# EAGLE design LPC1115_4TE_TOP V1.0 (EAGLE 7.6.0)
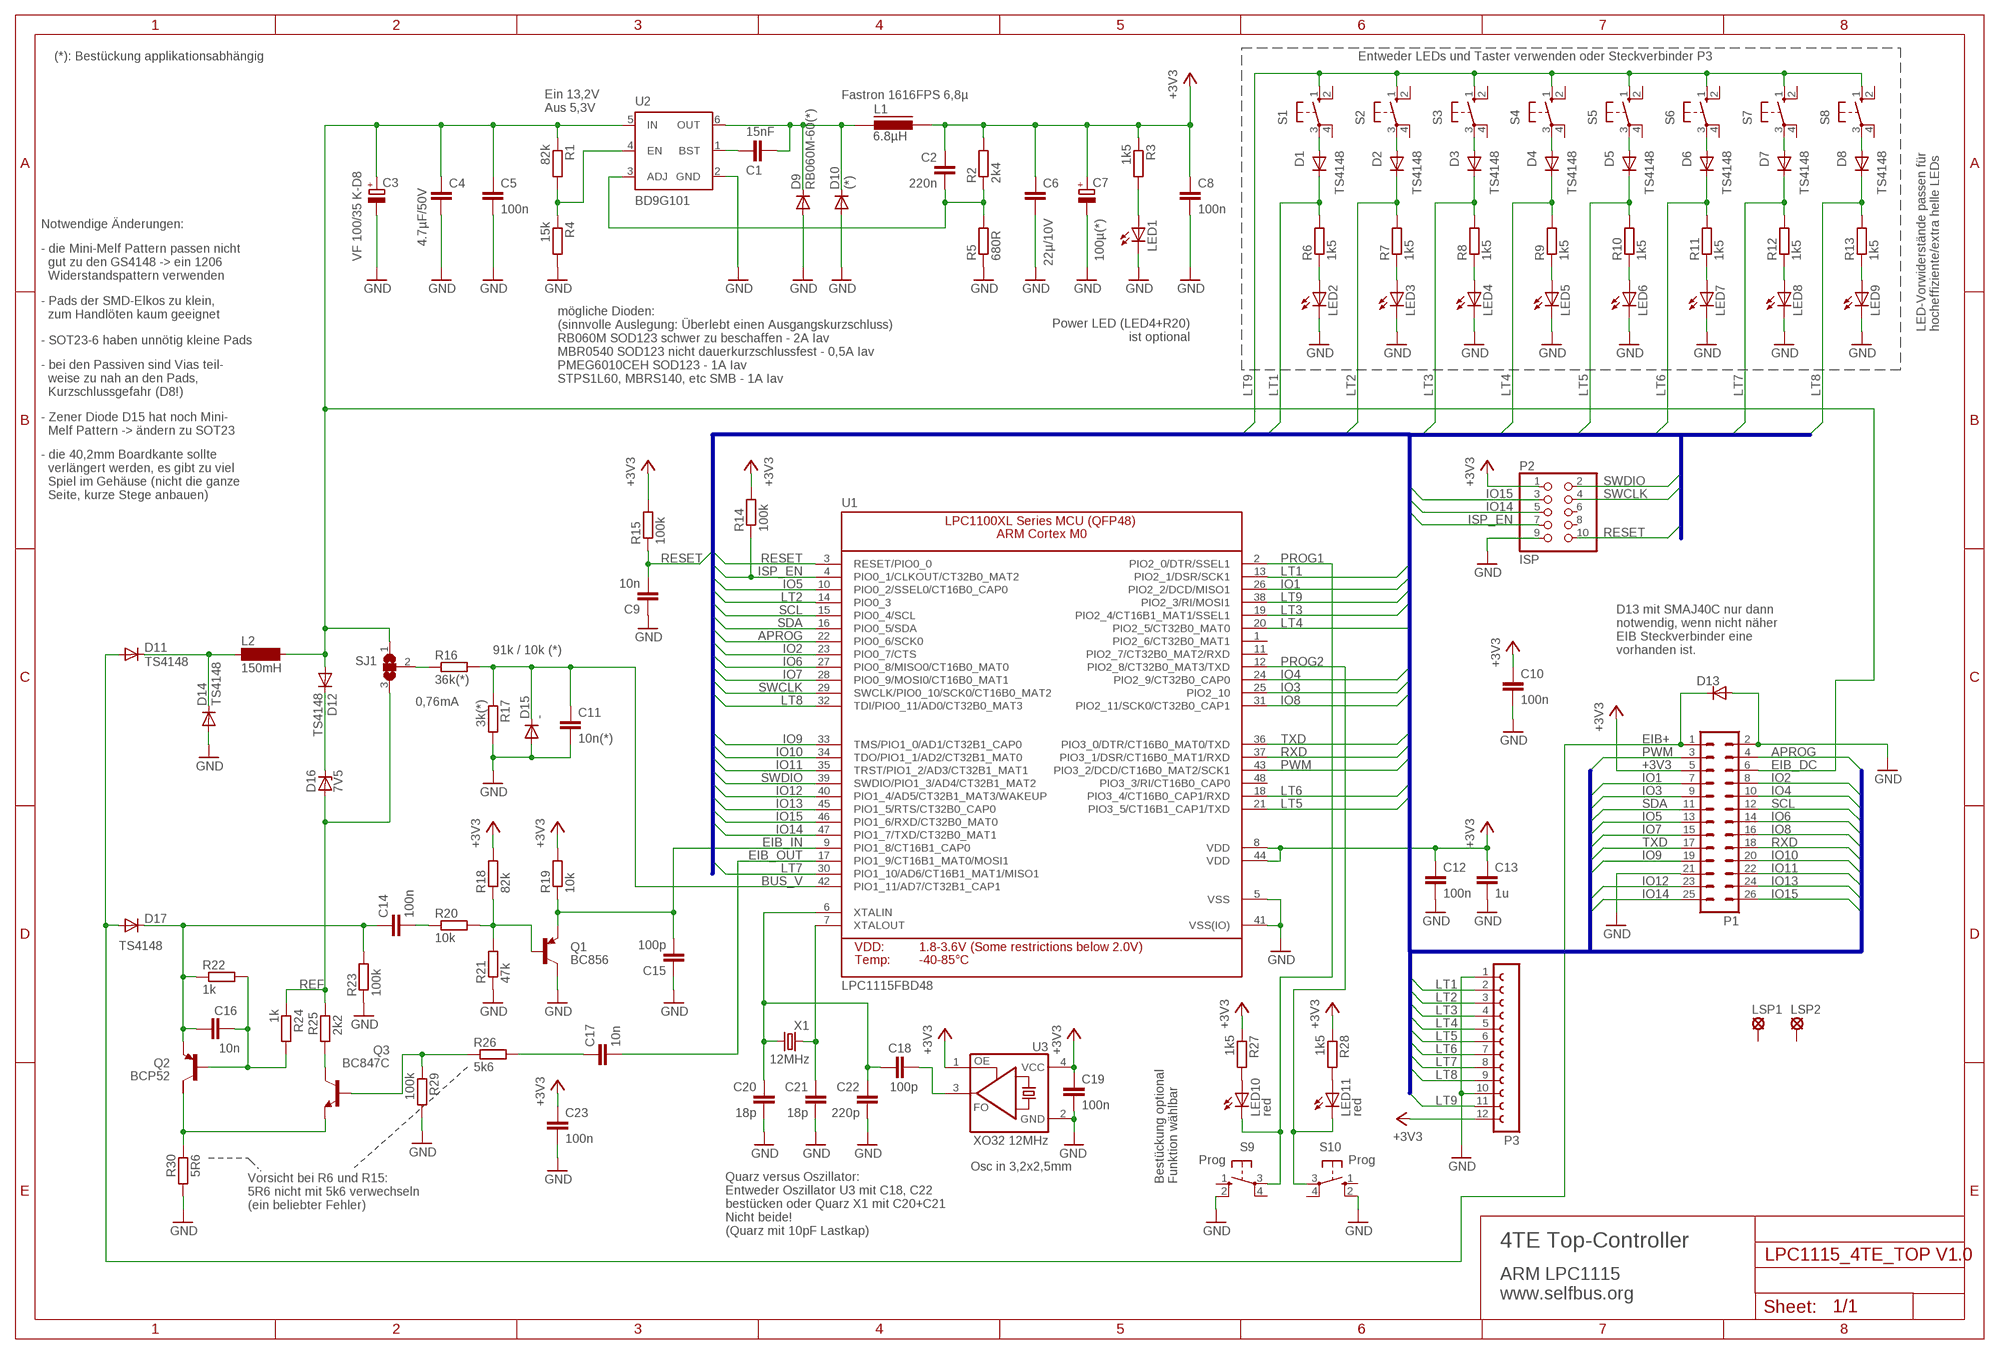
[diagram p0: schematic, sheet 1]

## Parts
C1  15nF  C-EUC0805M  [R0805M]
C2  220n  C-EUC0805M  [R0805M]
C3  VF 100/35 K-D8  CPOL-EUUD-6,3X7,7  [UD-6,3X7,7_NICHICON]
C4  4.7µF/50V  C-EUC1206M  [R1206M]
C5  100n  C-EUC0805M  [R0805M]
C6  22µ/10V  C-EUC1210K  [C1210K]
C7  100µ(*)  CPOL-EUUD-6,3X7,7  [UD-6,3X7,7_NICHICON]
C8  100n  C-EUC0805M  [R0805M]
C9  10n  C-EUC0805M  [R0805M]
C10  100n  C-EUC0805M  [R0805M]
C11  10n(*)  C-EUC0805M  [R0805M]
C12  100n  C-EUC0805M  [R0805M]
C13  1u  C-EUC0805M  [R0805M]
C14  100n  C-EUC0805M  [R0805M]
C15  100p  C-EUC0805M  [R0805M]
C16  10n  C-EUC0805M  [R0805M]
C17  10n  C-EUC0805M  [R0805M]
C18  100p  C-EUC0805M  [R0805M]
C19  100n  C-EUC0805M  [R0805M]
C20  18p  C-EUC0805M  [R0805M]
C21  18p  C-EUC0805M  [R0805M]
C22  220p  C-EUC0805M  [R0805M]
C23  100n  C-EUC0805M  [R0805M]
D1  TS4148  DIODE-MINIMELF  [MINIMELF]
D2  TS4148  DIODE-MINIMELF  [MINIMELF]
D3  TS4148  DIODE-MINIMELF  [MINIMELF]
D4  TS4148  DIODE-MINIMELF  [MINIMELF]
D5  TS4148  DIODE-MINIMELF  [MINIMELF]
D6  TS4148  DIODE-MINIMELF  [MINIMELF]
D7  TS4148  DIODE-MINIMELF  [MINIMELF]
D8  TS4148  DIODE-MINIMELF  [MINIMELF]
D9  RB060M-60(*)  DIODE-SOD123  [SOD123]
D10  (*)  DIODE-SMB  [SMB]
D11  TS4148  DIODE-MINIMELF  [MINIMELF]
D12  TS4148  DIODE-MINIMELF  [MINIMELF]
D13  D-SMB  [SMB]
D14  TS4148  DIODE-MINIMELF  [MINIMELF]
D15  -  DIODE-MINIMELF  [MINIMELF]
D16  7V5  ZENER-DIODESOT23  [SOT23]
D17  TS4148  DIODE-MINIMELF  [MINIMELF]
L1  6.8µH  IND_FASTRON_1616FPSB  [1616FPS]
L2  150mH  SD12BS11_LIEGEND  [BS11_LIEGEND]
LED1  LEDSMT1206  [1206]
LED2  LEDSMT1206  [1206]
LED3  LEDSMT1206  [1206]
LED4  LEDSMT1206  [1206]
LED5  LEDSMT1206  [1206]
LED6  LEDSMT1206  [1206]
LED7  LEDSMT1206  [1206]
LED8  LEDSMT1206  [1206]
LED9  LEDSMT1206  [1206]
LED10  red  LEDSMT1206  [1206]
LED11  red  LEDSMT1206  [1206]
LSP1  SE13_SM  [SE13_SM]
LSP2  SE13_SM  [SE13_SM]
P1  ML26  [ML26]
P2  ISP  PINHD-2X05_2.00  [2X05M]
P3  FE12-1  [FE12]
Q1  BC856  BC856BSMD  [SOT23-BEC]
Q2  BCP52  FZT753SMD  [SOT223]
Q3  BC847C  BC847  [SOT23]
R1  82k  R-EU_R0805M  [R0805M]
R2  2k4  R-EU_R0805M  [R0805M]
R3  1k5  R-EU_R0805M  [R0805M]
R4  15k  R-EU_R0805M  [R0805M]
R5  680R  R-EU_R0805M  [R0805M]
R6  1k5  R-EU_R0805M  [R0805M]
R7  1k5  R-EU_R0805M  [R0805M]
R8  1k5  R-EU_R0805M  [R0805M]
R9  1k5  R-EU_R0805M  [R0805M]
R10  1k5  R-EU_R0805M  [R0805M]
R11  1k5  R-EU_R0805M  [R0805M]
R12  1k5  R-EU_R0805M  [R0805M]
R13  1k5  R-EU_R0805M  [R0805M]
R14  100k  R-EU_R0805M  [R0805M]
R15  100k  R-EU_R0805M  [R0805M]
R16  36k(*)  R-EU_R0805M  [R0805M]
R17  3k(*)  R-EU_R0805M  [R0805M]
R18  82k  R-EU_R0805M  [R0805M]
R19  10k  R-EU_R0805M  [R0805M]
R20  10k  R-EU_R0805M  [R0805M]
R21  47k  R-EU_R0805M  [R0805M]
R22  1k  R-EU_R0805M  [R0805M]
R23  100k  R-EU_R0805M  [R0805M]
R24  1k  R-EU_R0805M  [R0805M]
R25  2k2  R-EU_R0805M  [R0805M]
R26  5k6  R-EU_R0805M  [R0805M]
R27  1k5  R-EU_R0805M  [R0805M]
R28  1k5  R-EU_R0805M  [R0805M]
R29  100k  R-EU_R0805M  [R0805M]
R30  5R6  R-EU_R1206M  [R1206M]
S1  10-XXSMD  [B3F-10XX_SMD]
S2  10-XXSMD  [B3F-10XX_SMD]
S3  10-XXSMD  [B3F-10XX_SMD]
S4  10-XXSMD  [B3F-10XX_SMD]
S5  10-XXSMD  [B3F-10XX_SMD]
S6  10-XXSMD  [B3F-10XX_SMD]
S7  10-XXSMD  [B3F-10XX_SMD]
S8  10-XXSMD  [B3F-10XX_SMD]
S9  Prog  10-XXSMD  [B3F-10XX_SMD]
S10  Prog  10-XXSMD  [B3F-10XX_SMD]
SJ1  SJ2W  [SJ_2]
U1  LPC1115FBD48  LPC1113/4/5_QFP48_XLSERIES  [LQFP48]
U2  BD9G101  BD9G101GBD9G101G-SOT23-6  [SOT23-6]
U3  XO32 12MHz  ASFL  [ASF]
X1  12MHz  CRYSTALASF  [ASF]

## Nets
+3V3: C2.1 C6.1 C7.+ C8.1 C10.1 C12.1 C13.1 C19.1 C23.1 L1.P$2 P1.5 P2.1 P3.12 R2.2 R3.1 R14.2 R15.2 R18.2 R19.2 R27.1 R28.1 U1.8(VDD) U1.44(VDD) U3.1(OE) U3.4(VCC)
APROG: P1.4 U1.22(PIO0_6/SCK0)
BUS_V: C11.1 D15.C R16.2 R17.1 U1.42(PIO1_11/AD7/CT32B1_CAP1)
DRAIN: C14.1 C16.1 D17.C Q2.3(E) R22.1 R23.2
EIB+: D11.A D13.1(C) D17.A P1.1
EIB_DC: C3.+ C4.1 C5.1 D12.A L2.2 P1.6 R1.1 SJ1.1 U2.5(IN)
EIB_IN: C15.2 Q1.E R19.1 U1.9(PIO1_8/CT16B1_CAP0)
EIB_OUT: C17.2 U1.17(PIO1_9/CT16B1_MAT0/MOSI1)
GND: C3.- C4.2 C5.2 C6.2 C7.- C8.2 C9.1 C10.2 C11.2 C12.2 C13.2 C15.1 C19.2 C20.2 C21.2 C22.2 C23.2 D9.A D10.A D13.2(A) D14.A D15.A LED1.C LED2.C LED3.C LED4.C LED5.C LED6.C LED7.C LED8.C LED9.C P1.2 P1.21 P2.9 P3.1 P3.10 Q1.C R4.2 R5.1 R17.2 R21.1 R23.1 R29.2 R30.1 S9.2(S1) S10.2(S1) U1.5(VSS) U1.41(VSS(IO)) U2.2(GND) U3.2(GND)
IO1: P1.7 U1.26(PIO2_2/DCD/MISO1)
IO2: P1.8 U1.23(PIO0_7/CTS)
IO3: P1.9 U1.25(PIO2_10)
IO4: P1.10 U1.24(PIO2_9/CT32B0_CAP0)
IO5: P1.13 U1.10(PIO0_2/SSEL0/CT16B0_CAP0)
IO6: P1.14 U1.27(PIO0_8/MISO0/CT16B0_MAT0)
IO7: P1.15 U1.28(PIO0_9/MOSI0/CT16B0_MAT1)
IO8: P1.16 U1.31(PIO2_11/SCK0/CT32B0_CAP1)
IO9: P1.19 U1.33(TMS/PIO1_0/AD1/CT32B1_CAP0)
IO10: P1.20 U1.34(TDO/PIO1_1/AD2/CT32B1_MAT0)
IO11: P1.22 U1.35(TRST/PIO1_2/AD3/CT32B1_MAT1)
IO12: P1.23 U1.40(PIO1_4/AD5/CT32B1_MAT3/WAKEUP)
IO13: P1.24 U1.45(PIO1_5/RTS/CT32B0_CAP0)
IO14: P1.25 P2.5 U1.47(PIO1_7/TXD/CT32B0_MAT1)
IO15: P1.26 P2.3 U1.46(PIO1_6/RXD/CT32B0_MAT0)
ISP_EN: P2.7 R14.1 U1.4(PIO0_1/CLKOUT/CT32B0_MAT2)
LT1: D1.C P3.2 R6.2 U1.13(PIO2_1/DSR/SCK1)
LT2: D2.C P3.3 R7.2 U1.14(PIO0_3)
LT3: D3.C P3.4 R8.2 U1.19(PIO2_4/CT16B1_MAT1/SSEL1)
LT4: D4.C P3.5 R9.2 U1.20(PIO2_5/CT32B0_MAT0)
LT5: D5.C P3.6 R10.2 U1.21(PIO3_5/CT16B1_CAP1/TXD)
LT6: D6.C P3.7 R11.2 U1.18(PIO3_4/CT16B0_CAP1/RXD)
LT7: D7.C P3.8 R12.2 U1.30(PIO1_10/AD6/CT16B1_MAT1/MISO1)
LT8: D8.C P3.9 R13.2 U1.32(TDI/PIO0_11/AD0/CT32B0_MAT3)
LT9: P3.11 S1.1(S) S2.1(S) S3.1(S) S4.1(S) S5.1(S) S6.1(S) S7.1(S) S8.1(S) U1.38(PIO2_3/RI/MOSI1)
LX: C1.1 D9.C D10.C L1.P$1 U2.6(OUT)
N$1: C17.1 R26.2
N$2: C14.2 R20.1
N$3: C21.1 U1.7(XTALOUT) X1.1
N$4: LED11.A R28.2
N$5: R16.1 SJ1.2
N$6: Q3.3(C) R25.1
N$7: Q2.2(C) Q3.2(E) R30.2
N$8: D11.C D14.C L2.1
N$9: D12.C D16.3(C)
N$12: Q3.1(B) R26.1 R29.1
N$13: LED1.A R3.2
N$14: Q1.B R18.1 R20.2 R21.2
N$15: C16.2 Q2.1(B) R22.2 R24.2
N$16: C18.1 U3.3(FO)
N$17: D8.A S8.3(P)
N$19: C1.2 U2.1(BST)
N$20: R1.2 R4.1 U2.4(EN)
N$22: C18.2 C20.1 C22.1 U1.6(XTALIN) X1.3
N$23: D7.A S7.3(P)
N$24: C2.2 R2.1 R5.2 U2.3(ADJ)
N$25: LED2.A R6.1
N$28: D6.A S6.3(P)
N$29: D5.A S5.3(P)
N$30: D4.A S4.3(P)
N$31: D3.A S3.3(P)
N$32: D2.A S2.3(P)
N$33: LED3.A R7.1
N$34: D1.A S1.3(P)
N$35: LED10.A R27.2
N$48: LED4.A R8.1
N$50: LED5.A R9.1
N$51: LED6.A R10.1
N$53: LED7.A R11.1
N$55: LED8.A R12.1
N$57: LED9.A R13.1
PROG1: LED10.C S9.3(P) U1.2(PIO2_0/DTR/SSEL1)
PROG2: LED11.C S10.3(P) U1.12(PIO2_8/CT32B0_MAT3/TXD)
PWM: P1.3 U1.43(PIO3_2/DCD/CT16B0_MAT2/SCK1)
REF: D16.1(A) R24.1 R25.2 SJ1.3
RESET: C9.2 P2.10 R15.1 U1.3(RESET/PIO0_0)
RXD: P1.18 U1.37(PIO3_1/DSR/CT16B0_MAT1/RXD)
SCL: P1.12 U1.15(PIO0_4/SCL)
SDA: P1.11 U1.16(PIO0_5/SDA)
SWCLK: P2.4 U1.29(SWCLK/PIO0_10/SCK0/CT16B0_MAT2)
SWDIO: P2.2 U1.39(SWDIO/PIO1_3/AD4/CT32B1_MAT2)
TXD: P1.17 U1.36(PIO3_0/DTR/CT16B0_MAT0/TXD)
Unconnected: LSP1.MP LSP2.MP P2.6 P2.8 Q2.4(C/) S1.2(S1) S1.4(P1) S2.2(S1) S2.4(P1) S3.2(S1) S3.4(P1) S4.2(S1) S4.4(P1) S5.2(S1) S5.4(P1) S6.2(S1) S6.4(P1) S7.2(S1) S7.4(P1) S8.2(S1) S8.4(P1) S9.1(S) S9.4(P1) S10.1(S) S10.4(P1) U1.1(PIO2_6/CT32B0_MAT1) U1.11(PIO2_7/CT32B0_MAT2/RXD) U1.48(PIO3_3/RI/CT16B0_CAP0)

## Buses
IO[1..15],LT[1..9],SCL,SDA,PWM,APROG,RXD,TXD,RESET,SWCLK,SWDIO,ISP_EN

## Notes on the sheet
- (*): Bestückung applikationsabhängig | Entweder LEDs und Taster verwenden oder Steckverbinder P3
- Fastron 1616FPS 6,8µ
- Ein 13,2V
  Aus 5,3V
- Notwendige Änderungen:
- - die Mini-Melf Pattern passen nicht
    gut zu den GS4148 -> ein 1206
    Widerstandspattern verwenden
- - Pads der SMD-Elkos zu klein,
    zum Handlöten kaum geeignet
- Power LED (LED4+R20)
  ist optional
- LED-Vorwiderstände passen für 
  hocheffiziente/extra helle LEDs
- - SOT23-6 haben unnötig kleine Pads
- mögliche Dioden:
  (sinnvolle Auslegung: Überlebt einen Ausgangskurzschluss)
  RB060M SOD123 schwer zu beschaffen - 2A Iav
  MBR0540 SOD123 nicht dauerkurzschlussfest - 0,5A Iav
  PMEG6010CEH SOD123 - 1A Iav
  STPS1L60, MBRS140, etc SMB - 1A Iav
- - bei den Passiven sind Vias teil-
    weise zu nah an den Pads,
    Kurzschlussgefahr (D8!)
- - Zener Diode D15 hat noch Mini-
    Melf Pattern -> ändern zu SOT23
- - die 40,2mm Boardkante sollte
    verlängert werden, es gibt zu viel
    Spiel im Gehäuse (nicht die ganze
    Seite, kurze Stege anbauen)
- 91k / 10k (*)
- D13 mit SMAJ40C nur dann
  notwendig, wenn nicht näher
  EIB Steckverbinder eine
  vorhanden ist.
- 0,76mA
- Osc in 3,2x2,5mm
- Bestückung optional
  Funktion wählbar
- Vorsicht bei R6 und R15:
  5R6 nicht mit 5k6 verwechseln
  (ein beliebter Fehler)
- Quarz versus Oszillator:
  Entweder Oszillator U3 mit C18, C22
  bestücken oder Quarz X1 mit C20+C21
  Nicht beide!
  (Quarz mit 10pF Lastkap)
- 4TE Top-Controller
- ARM LPC1115
  www.selfbus.org

## Library data of the parts
C1 C2 C4-C6 C8-C23 = rcl:C-EU: CAPACITOR, European symbol
C3 C7 = rcl:CPOL-EU: POLARIZED CAPACITOR, European symbol
D1-D12 D14 D15 D17 = diode:DIODE-: DIODE
D13 = semicon-smd-ipc:D-: DIODE unfilled
D16 = diode:ZENER-DIODE: Z-Diode
L1 = Stefan_selfbus:IND_FASTRON_1616FPS
L2 = inductor-neosid:SD12: INDUCTOR nominal inductance
LED1-LED11 = led:LED: LED OSRAM: - CHIPLED LG R971, LG N971, LY N971, LG Q971, LY Q971, LO R971, LY R971 LH N974, LH R974 LS Q976, LO Q976, LY Q976 LO Q996 - Hyper CHIPLED LW Q18S LB Q993, LB Q99A, LB R99A - SideLED LS A670, LO A670, LY A670, LG A670, LP A670 LB A673, LV A673, LT A673, LW A673 LH A674 LY A675 LS A676, LA A676, LO A676, LY A676, LW A676 LS A679, LY A679, LG A679 - Hyper Micro SIDELED® LS Y876, LA Y876, LO Y876, LY Y876 LT Y87S - SmartLED LW L88C, LW L88S LB L89C, LB L89S, LG L890 LS L89K, LO L89K, LY L89K LS L896, LA L896, LO L896, LY L896 - TOPLED LS T670, LO T670, LY T670, LG T670, LP T670 LSG T670, LSP T670, LSY T670, LOP T670, LYG T670 LG T671, LOG T671, LSG T671 LB T673, LV T673, LT T673, LW T673 LH T674 LS T676, LA T676, LO T676, LY T676, LB T676, LH T676, LSB T676, LW T676 LB T67C, LV T67C, LT T67C, LS T67K, LO T67K, LY T67K, LW E67C LS E67B, LA E67B, LO E67B, LY E67B, LB E67C, LV E67C, LT E67C LW T67C LS T679, LY T679, LG T679 LS T770, LO T770, LY T770, LG T770, LP T770 LB T773, LV T773, LT T773, LW T773 LH T774 LS E675, LA E675, LY E675, LS T675 LS T776, LA T776, LO T776, LY T776, LB T776 LHGB T686 LT T68C, LB T68C - Hyper Mini TOPLED® LB M676 - Mini TOPLED Santana® LG M470 LS M47K, LO M47K, LY M47K Source: http://www.osram.convergy.de - LUMILED® LXK2-PW12-R00, LXK2-PW12-S00, LXK2-PW14-U00, LXK2-PW14-V00 LXK2-PM12-R00, LXK2-PM12-S00, LXK2-PM14-U00 LXK2-PE12-Q00, LXK2-PE12-R00, LXK2-PE12-S00, LXK2-PE14-T00, LXK2-PE14-U00 LXK2-PB12-K00, LXK2-PB12-L00, LXK2-PB12-M00, LXK2-PB14-N00, LXK2-PB14-P00, LXK2-PB14-Q00 LXK2-PR12-L00, LXK2-PR12-M00, LXK2-PR14-Q00, LXK2-PR14-R00 LXK2-PD12-Q00, LXK2-PD12-R00, LXK2-PD12-S00 LXK2-PH12-R00, LXK2-PH12-S00 LXK2-PL12-P00, LXK2-PL12-Q00, LXK2-PL12-R00 Source: www.luxeon.com
LSP1 LSP2 = solpad:SE13: SOLDER PAD E1542, drill 1,3mm, distributor Buerklin, 07F815
P1 = con-harting-ml:ML26: HARTING; OC_FARNELL: unknown; OC_NEWARK: unknown
P2 = pinhead-2:PINHD-2X05: PIN HEADER
P3 = con-lsta:FE12-1: FEMALE HEADER; OC_FARNELL: unknown; OC_NEWARK: unknown
Q1 = transistor-pnp:BC856*: PNP Transistror
Q2 = transistor-pnp:FZT753SMD: PNP Transistor
Q3 = transistor:BC847: NPN TRANSISTOR
R1-R30 = rcl:R-EU_: RESISTOR, European symbol
S1-S10 = switch-omron:10-XX: OMRON SWITCH
SJ1 = jumper:SJ2W: SMD solder JUMPER
U1 = microbuilder:LPC1113/4/5_QFP48_XLSERIES: LPC1113/4/5 ARM Cortex M0 MCU (50MHz) - XL Series (FBD48/3x3) LPC1115FBD48/303: Max Frequency: 50MHz Flash: 64kB SRAM: 8kB ADC: 10-bit
U2 = Stefan_selfbus:BD9G101G
U3 = crystal:ASF*: CRYSTAL CLOCK OSCILLATORS 5.0 Vdc or 3.3 Vdc - LOW PROFILE ULTRA MINIATURE CERAMIC SURFACE MOUNT Source: http://www.abracon.com/Oscillators/asf1-L-L1.pdf
X1 = crystal:CRYSTAL: CRYSTAL

## Board
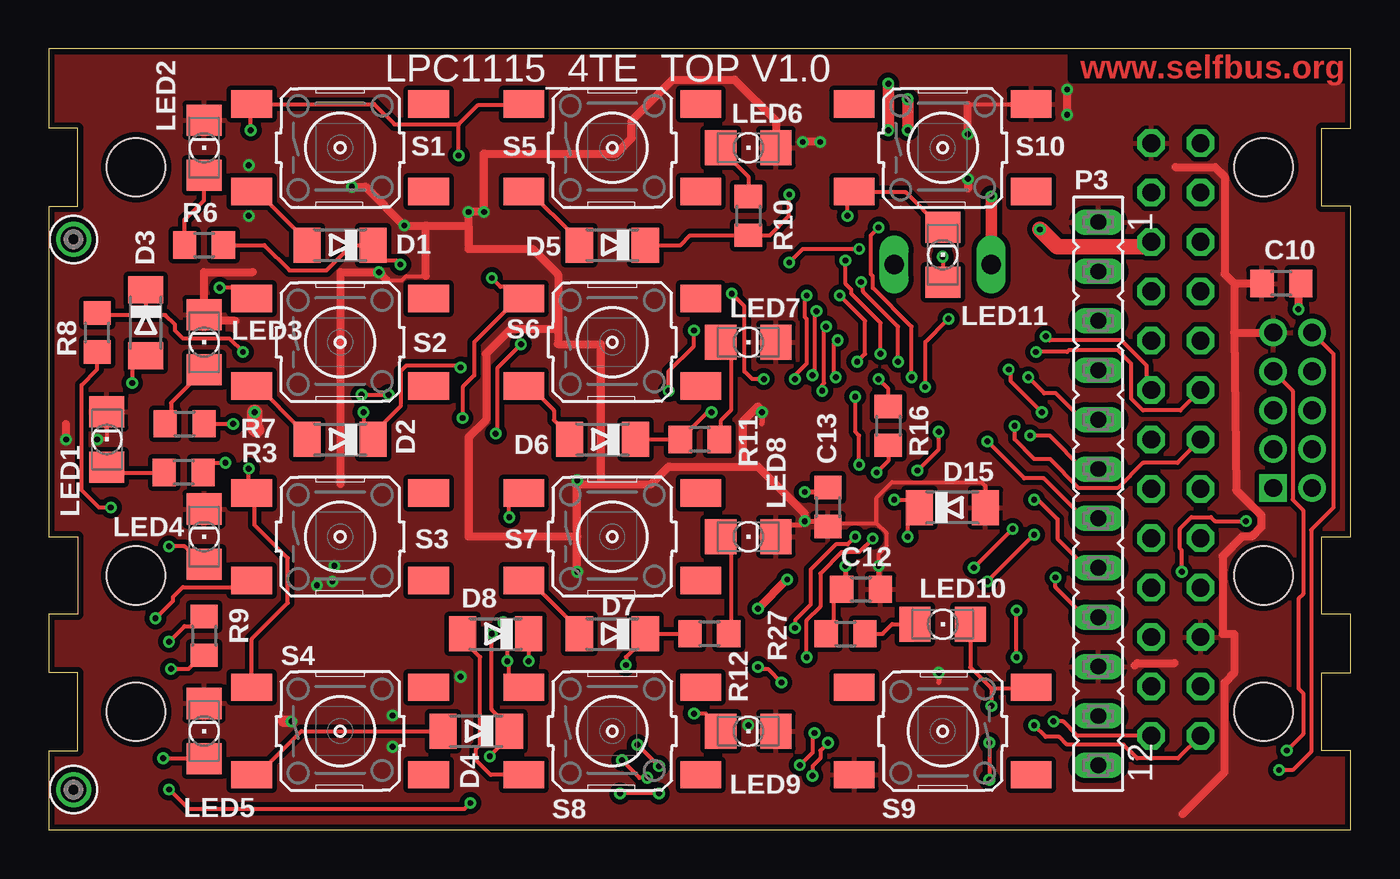
[diagram p1: board, top side]
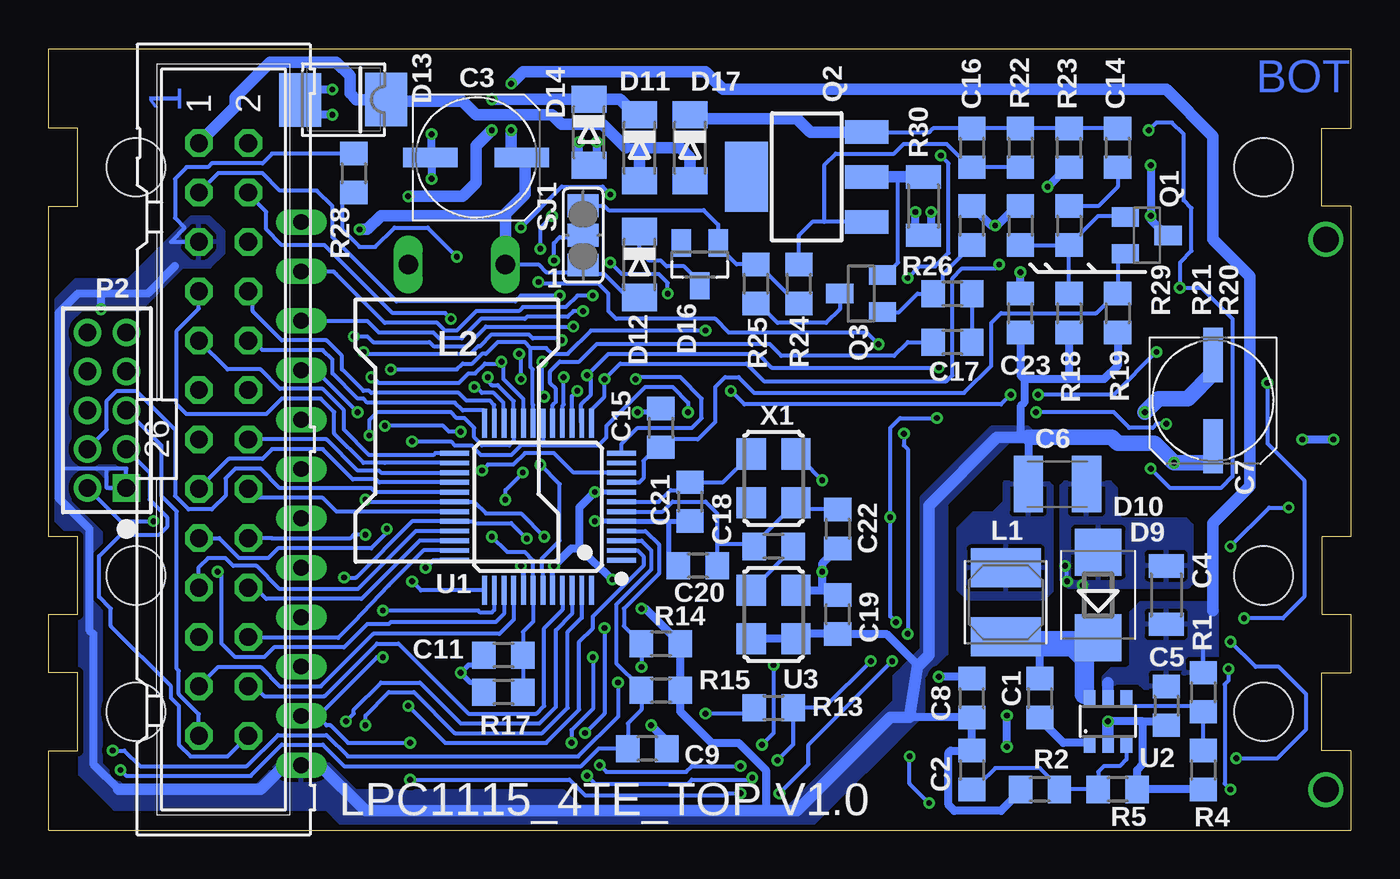
[diagram p2: board, bottom side, seen from below]

Size 67 x 40.2 mm. Coordinates in mm from the lower left corner, seen from the top.
Outline: 67,0 67,4.1 65.5,4.1 65.5,8.1 67,8.1 67,11.1 65.5,11.1 65.5,15.1 67,15.1 67,32.1 65.5,32.1 65.5,36.1 67,36.1 67,40.2 0,40.2 0,36.1 1.5,36.1 1.5,32.1 0,32.1 0,15.1 1.5,15.1 1.5,11.1 0,11.1 0,8.1 1.5,8.1 1.5,4.1 0,4.1 0,0 67,0
Copper layers (1*16): Top 0.035mm / dielectric 1.5mm / Bottom 0.035mm
Design rules "default *": minimum track width 0.18mm, minimum drill 0.3mm, track to track 0.18mm, track to pad 0.18mm, pad to pad 0.18mm, via to via 0.18mm, smd to smd 0.18mm, copper to edge 0.3mm, drill to drill 0.3mm, minimum pad ring 0.25mm, minimum via ring 0.15mm, stop-mask expansion 0.075mm, vias tented up to drill 12mil, thermal gap 0.2mm
Holes 3 mm at 62.5,6.1 4.5,6.1 4.5,34.1 62.5,34.1 4.5,13.1 62.5,13.1
bRestrict: area 23.6,16 to 24,16.2

### Footprints (pad centres in the part's own frame; a part is rotated, then mirrored left to right if it is on the bottom)
R0805M = smd 1.2 x 1.4: 1 -1,0; 2 1,0
UD-6,3X7,7_NICHICON = smd 2.8 x 1: + 2.35,0; - -2.35,0
R1206M = smd 1.2 x 1.8: 1 -1.5,0; 2 1.5,0
C1210K = smd 1.5 x 2.9: 1 -1.5,0; 2 1.5,0
MINIMELF = smd 1.4 x 1.8: A 1.7,0; C -1.7,0
SOD123 = smd 1.4 x 1.4: A 1.9,0; C -1.9,0
SMB = smd 2.4 x 2.4: A 2.2,0; C -2.2,0
SMB' = smd 2.159 x 2.743: 1 -2.311,-0.127; 2 2.108,-0.102
SOT23 = smd 1 x 1.4: 1 -0.95,-1.1; 2 0.95,-1.1; 3 0,1.1
1616FPS = smd 3.6 x 2: P$1 0,1.775; P$2 0,-1.775
BS11_LIEGEND = drill 1 long: 1 -2.5,0; 2 2.5,0
1206 = smd 1.6 x 1.803: A -1.422,0; C 1.422,0
SE13_SM = drill 1.3: MP 0,0
ML26 = drill 0.914 octagon: 1 -15.24,-1.27; 2 -15.24,1.27; 3 -12.7,-1.27; 4 -12.7,1.27; 5 -10.16,-1.27; 6 -10.16,1.27; 7 -7.62,-1.27; 8 -7.62,1.27; 9 -5.08,-1.27; 10 -5.08,1.27; 11 -2.54,-1.27; 12 -2.54,1.27; 13 0,-1.27; 14 0,1.27; 15 2.54,-1.27; 16 2.54,1.27; 17 5.08,-1.27; 18 5.08,1.27; 19 7.62,-1.27; 20 7.62,1.27; 21 10.16,-1.27; 22 10.16,1.27; 23 12.7,-1.27; 24 12.7,1.27; 25 15.24,-1.27; 26 15.24,1.27
2X05M = drill 0.914 square: 1 -4,-1 | drill 0.914: 2 -4,1; 3 -2,-1; 4 -2,1; 5 0,-1; 6 0,1; 7 2,-1; 8 2,1; 9 4,-1; 10 4,1
FE12 = drill 0.813 long: 1 -13.97,0; 2 -11.43,0; 3 -8.89,0; 4 -6.35,0; 5 -3.81,0; 6 -1.27,0; 7 1.27,0; 8 3.81,0; 9 6.35,0; 10 8.89,0; 11 11.43,0; 12 13.97,0
SOT23-BEC = smd 1 x 1.4: B -0.95,-1.1; C 0,1.1; E 0.95,-1.1
SOT223 = smd 1.219 x 2.235: 1 -2.311,-3.099; 2 0,-3.099; 3 2.311,-3.099 | smd 3.6 x 2.2: 4 0,3.099
B3F-10XX_SMD = smd 2.1 x 1.4: 1 -4.55,2.25; 2 4.55,2.25; 3 -4.55,-2.25; 4 4.55,-2.25
SJ_2 = smd 1.168 x 1.6: 1 -1.524,0; 2 0,0; 3 1.524,0
LQFP48 = smd 1.5 x 0.25: 1 -4.3,2.75; 2 -4.3,2.25; 3 -4.3,1.75; 4 -4.3,1.25; 5 -4.3,0.75; 6 -4.3,0.25; 7 -4.3,-0.25; 8 -4.3,-0.75; 9 -4.3,-1.25; 10 -4.3,-1.75; 11 -4.3,-2.25; 12 -4.3,-2.75; 25 4.3,-2.75; 26 4.3,-2.25; 27 4.3,-1.75; 28 4.3,-1.25; 29 4.3,-0.75; 30 4.3,-0.25; 31 4.3,0.25; 32 4.3,0.75; 33 4.3,1.25; 34 4.3,1.75; 35 4.3,2.25; 36 4.3,2.75 | smd 0.25 x 1.5: 13 -2.75,-4.3; 14 -2.25,-4.3; 15 -1.75,-4.3; 16 -1.25,-4.3; 17 -0.75,-4.3; 18 -0.25,-4.3; 19 0.25,-4.3; 20 0.75,-4.3; 21 1.25,-4.3; 22 1.75,-4.3; 23 2.25,-4.3; 24 2.75,-4.3; 37 2.75,4.3; 38 2.25,4.3; 39 1.75,4.3; 40 1.25,4.3; 41 0.75,4.3; 42 0.25,4.3; 43 -0.25,4.3; 44 -0.75,4.3; 45 -1.25,4.3; 46 -1.75,4.3; 47 -2.25,4.3; 48 -2.75,4.3
SOT23-6 = smd 0.6 x 0.9: 1 -0.95,-1.15; 2 0,-1.15; 3 0.95,-1.15; 4 0.95,1.15; 5 0,1.15; 6 -0.95,1.15
ASF = smd 1.6 x 1.5: 1 -1.25,-1.15; 2 1.25,-1.15; 3 1.25,1.15; 4 -1.25,1.15

### Placement (x,y rotation side)
C1  16,6.8 270 bottom
C2  19.5,3.1 270 bottom
C3  45,34.6 0 bottom
C4  9.5,12.1 90 bottom
C5  9.5,6.4 270 bottom
C6  15.1,17.8 0 bottom
C7  7.1,22.1 270 bottom
C8  19.5,6.8 90 bottom
C9  36.2,4.2 180 bottom
C10  63.42,28.12 180 top
C11  43.6,9 180 bottom
C12  41.8,12.4 0 top
C13  40.1,16.62 270 top
C14  12,35.1 270 bottom
C15  35.5,20.7 270 bottom
C16  19.5,35.1 270 bottom
C17  20.5,25.1 180 bottom
C18  29.7,14.6 180 bottom
C19  26.4,11.1 90 bottom
C20  33.6,13.6 180 bottom
C21  34,16.9 270 bottom
C22  26.4,15.5 270 bottom
C23  17,26.6 90 bottom
D1  15,30.1 180 top
D2  15,20.1 180 top
D3  5,26.1 270 top
D4  22,5.1 180 top
D5  29,30.1 180 top
D6  28.5,20.1 180 top
D7  29,10.1 180 top
D8  23,10.1 180 top
D9  13,12.1 90 bottom
D10  13,12.1 90 bottom
D11  36.6,35.1 270 bottom
D12  36.6,29.1 270 bottom
D13  [SMB']  51.95,37.45 180 bottom
D14  39.2,35.9 270 bottom
D15  46.5,16.6 0 top
D16  33.5,29.1 180 bottom
D17  34,35.1 270 bottom
L1  17.76,11.73 180 bottom
L2  46,29.1 0 bottom
LED1  3,20.1 90 top
LED2  8,35.1 90 top
LED3  8,25.1 90 top
LED4  8,15.1 90 top
LED5  8,5.1 90 top
LED6  36,35.1 0 top
LED7  36,25.1 0 top
LED8  36,15.1 0 top
LED9  36,5.1 0 top
LED10  46,10.6 0 top
LED11  46,29.6 90 top
LSP1  1.28,30.39 0 top
LSP2  1.28,2.09 0 top
P1  58,20.1 270 bottom
P2  64,21.6 90 bottom
P3  54,17.31 270 top
Q1  10.5,30.6 270 bottom
Q2  28,33.6 90 bottom
Q3  25.2,27.6 90 bottom
R1  7.6,7.1 270 bottom
R2  16,2.1 180 bottom
R3  6.95,18.4 180 top
R4  7.6,3.1 270 bottom
R5  12,2.1 180 bottom
R6  8,30.1 0 top
R7  7,20.9 0 top
R8  2.5,25.6 90 top
R9  8,10 270 top
R10  36,31.6 270 top
R11  33.5,20.1 180 top
R12  34,10.1 180 top
R13  29.7,6.3 0 bottom
R14  35.5,9.6 0 bottom
R15  35.5,7.2 0 bottom
R16  43.2,20.8 270 top
R17  43.6,7.1 180 bottom
R18  14.5,26.6 270 bottom
R19  12,26.6 270 bottom
R20  14.5,31.1 270 bottom
R21  17,31.1 270 bottom
R22  17,35.1 270 bottom
R23  14.5,35.1 90 bottom
R24  28.4,28.1 90 bottom
R25  30.6,28.1 90 bottom
R26  20.5,27.6 0 bottom
R27  41,10.1 0 top
R28  51.3,33.8 270 bottom
R29  19.5,31.1 90 bottom
R30  22,32.1 90 bottom
S1  15,35.1 0 top
S2  15,25.1 0 top
S3  15,15.1 0 top
S4  15,5.1 0 top
S5  29,35.1 0 top
S6  29,25.1 0 top
S7  29,15.1 0 top
S8  29,5.1 0 top
S9  46,5.1 180 top
S10  46,35.1 0 top
SJ1  39.5,30.6 90 bottom
U1  41.82,16.64 180 bottom
U2  12.5,5.6 0 bottom
U3  29.7,11.1 90 bottom
X1  29.7,18.1 270 bottom

### Tracks (layer width: path | path; a pad name or v marks a point on that pad's centre or on a via)
+3V3  (via drill 0.3)
  Top 0.2: R27.1 40.4,10.53 40.4,12 C12.1 | R3.1 8.4,18 8.4,18.9 v9.1,18.9
  Top 0.25: v38.9,17.4 40.08,17.4 C13.1 | v41,13.6 41,12.6 C12.1
  Top 0.4: C10.1 64.3,28.12 v64.3,26.8 | v38,12.9 v36.5,11.4
  Bottom 0.2: 64,18.6 66.5,18.6 | R28.1 55.5,34.8 56,34.3 58.6,34.3 58.8,34.1 59.9,34.1 60.5,33.5 60.5,31.49 60,31 60.7,30.26 P1.5 | 64,18.6 64,17.6 P2.1 63,18.6 64,18.6
  Bottom 0.25: U1.8 v38.89,17.39 v38.9,17.4 | U1.44 41.07,13.53 v41,13.6
  Bottom 0.4: 14.5,23.2 16.8,23.2 | R18.2 14.5,23.2 | C23.1 17,23.4 16.8,23.2 | 16.8,23.2 16.8,22 17,21.8 17,20.2 | 16.6,20.2 C6.1 | 60.5,29.03 61.9,27.6 64.3,27.6 | 64.3,27.6 65.5,27.6 66.5,26.6 66.5,18.6 66.5,17.1 64.9,15.5 64.9,10.3 64.7,10.1 64.7,3.4 63.4,2.1 | v38.9,17.4 39.7,16.6 39.7,14.5 | 39.7,14.5 v38,12.9 | v41,13.6 40.1,14.5 39.7,14.5 | v64.3,26.8 64.3,27.6 | R19.2 12,23.9 12.7,23.2 14.5,23.2 | 30.1,1 30.1,3.1 31.5,4.5 32.9,4.5 34.5,6.1 R15.2 R14.2 36.3,11.4 v36.5,11.4 | R2.2 17,2 18,1 20.4,1 20.7,1.3 20.7,4 20.6,4.1 C2.1 C8.1 22.7,5.8 | U3.4 U3.1 28.3,10.1 C19.1 23.9,10.1 22.25,8.45
  Bottom 0.6: 54.01,3.4 53.1,3.4 50.7,1 30.1,1 28.5,1 23.7,5.8 22.7,5.8 22.3,8.4 22.25,8.45 21.7,9 21.7,16.7 18.2,20.2 17,20.2 16.6,20.2 | 54.81,3.39 56.1,2.1 63.4,2.1
  Bottom 0.8: 16.6,20.2 12.3,20.2 12,19.9 10.1,19.9 v9.1,18.9 7.4,18.9 7.1,19.2 C7.+
  pour Bottom: 15.4,12.3 15.8,11.9 19.7,11.9 20.2,12.4 20.2,15.5 19.4,16.3 18.4,16.3 17.8,16.9 17.8,17.9 15.6,17.9 15.4,17.7
  pour Bottom (isolate 0.25): 16.4,20 16.3,20.1 16.3,20.4 16.6,20.7 18.5,20.7 22.1,17.1 22.1,9.3 23.5,7.9 23.5,6.6 28.9,1.2 39.7,1.2 40.5,2 51.2,2 52.8,3.6 55,3.6 56.3,2.3 63.2,2.3 64.3,3.4 64.3,15.3 65.9,16.9 65.9,17.9 65.6,18.2 64.5,18.2 63.9,17.6 63.2,17.6 63,17.8 63,18.5 63.2,18.7 65.2,18.7 65.9,19.4 65.9,26.2 65.3,26.8 62.3,26.8 60.1,29 58.7,29 58,29.7 58,30.8 58.7,31.5 59.7,31.5 62.9,28.3 65.6,28.3 66.9,27 66.9,16.2 65.4,14.7 65.4,2.9 63.6,1.1 52.7,1.1 52,0.4 42.8,0.4 42.4,0 28,0 22,6 22,7.9 20.8,9.1 20.8,16.8 17.6,20
APROG  (via drill 0.3)
  Top 0.2: v45.1,22.8 45.1,25.1 v46.3,26.3
  Bottom 0.2: v46.3,26.3 46.6,26.6 49.3,26.6 52.8,30.1 55,30.1 55.8,30.9 55.8,31.8 56.73,32.73 P1.4 | v45.1,22.8 45,22.8 44.7,22.5 44.1,22.5 43.6,22 43.6,21.7 43.57,21.67 U1.22
BUS_V  (via drill 0.3)
  Top 0.2: R16.2 43.2,19 v42.6,18.4 | v43.5,17 44.4,17 D15.C 44.2,16 v44.2,15.1
  Bottom 0.2: v44.2,15.1 43.4,14.3 42.5,14.3 42.07,13.87 U1.42 42.07,10.73 42.6,10.2 C11.1 R17.1 | v43.5,17 43.5,17.5 v42.6,18.4
DRAIN
  Bottom 0.2: C14.1 R23.2 R22.1 C16.1 21.5,36.1 21.69,35.91 Q2.3 | D17.C 34,36.6
  Bottom 0.6: 34,36.6 28.5,36.6 27.81,35.91 Q2.3
EIB+
  Bottom 0.4: 36.6,35.1 37.3,35.1
  Bottom 0.6: D17.A 34,34.6 34.5,35.1 36.6,35.1 D11.A | 37.3,35.1 38.5,36.3 40.6,36.3 41.1,36.8 45,36.8 45.7,37.5 49.56,37.5 D13.1 51.18,37.58 51.5,37.9 51.5,38.8 52.2,39.5 55.6,39.5 57.4,37.7 57.4,37.21 P1.1
EIB_DC  (via drill 0.3)
  Top 0.6: v43.2,36 v43.2,38.4
  Top 0.8: P1.6 56.47,30 51.9,30 v51,30.9
  Bottom 0.2: D12.A 37.2,27.4 38.4,28.6 39,28.6 39.5,29.1 SJ1.1 39.88,28.7 41.4,28.7 41.8,29.1 L2.2 | R1.1 7.6,9.3
  Bottom 0.6: L2.2 43.5,31.6 | 43.5,31.6 43.5,31.7 42.5,32.7 42.5,34.45 C3.+ 42.6,34.6 42.5,34.7 43.2,34.7 v43.2,36 | 7.1,11.3 7.1,15.8 5.2,17.7 5.2,28.5 7.1,30.4 7.1,35.7 9.5,38.1 32.3,38.1 33.2,39 42.6,39 v43.2,38.4 | v51,30.9 50.6,30.9 49.9,31.6 43.5,31.6 | U2.5 12.5,7.6
  pour Bottom: 12.7,7.3 12.7,7.9 12.3,8.3 11.5,8.3 11.3,8.5 11.3,11.2 10.8,11.7 7.2,11.7 6.9,11.4 6.9,8.8 7,8.7 7,8.3 7.3,8 8.7,8 9.5,7.3 10.6,7.3 10.9,7.6 12.1,7.6 12.3,7.4 12.3,7.3
EIB_IN
  Bottom 0.2: U1.9 36.61,17.89 36.4,18.1 36.4,19 35.6,19.8 | Q1.E 12,29.25 R19.1 12.1,27.6 13.1,26.6 18,26.6 18.5,26.1 18.5,23.9 19.9,22.5 30.7,22.5 31.5,23.3 32.2,23.3 32.7,22.8 32.7,21 33.6,20.1 35.3,20.1 35.6,19.8 | C15.2 35.6,19.8
EIB_OUT
  Bottom 0.2: U1.17 41.07,21.88 40.9,22.05 40.9,22.7 41.2,23 41.2,23.6 40.7,24.1 39.7,24.1 38.8,25 29.9,25 29.3,24.4 23.5,24.4 22.8,25.1 C17.2
GND  (via drill 0.3)
  Top 0.2: 17.4,28.3 18.2,28.3 18.4,28.5 19.4,28.5 | 8.32,26.2 LED3.C 7.98,26.5 | C13.2 40.42,15.62 40.6,15.8 42.6,15.8 | v42.7,13.6 42.7,14.2 43.1,14.6 43.1,15.3 42.6,15.8 | 42.6,15.8 42.6,17.1 43.4,17.9 48,17.9 48.2,17.7 D15.A | 47.3,37.3 47.35,37.35 S10.2 | LED1.C 3,20.1 v2.5,20.1 | 27.2,17.8 v27.2,18
  Top 0.25: LED8.C 37.42,15.12 38,15.7 38.7,15.7 v38.9,15.9 39.62,15.9 C13.2 | v42.7,13.6 42.7,12.5 C12.2 | v45.8,8.1 45.8,7.6 | v36.7,21.5 36.7,20.9
  Top 0.4: v27.2,13.3 27.2,15.1 | 27.2,15.1 27.2,17.8 28.4,17.8 | 57.97,34.1 60,34.1 60.5,33.6 60.5,28.6 61,28.1 | 61,28.1 61,28.12 C10.2 | 61,28.1 61,25.6 | 61,25.6 P2.9 | 61,25.6 61.1,17.5 62.4,16.2 62.4,15.6 61.9,15.1 61.4,15.1 60.4,14.1 60.4,10.1 61,10.1 61,8.1 60.5,7.6 60.5,3 58.35,0.85 | P1.21 59.43,10.1 | 19.4,31.1 v18.3,31.1 16.3,33.1 v15.6,33.1 | 19.4,31.1 21.6,31.1 | 21.6,31.1 v21.6,31.8 v22.4,31.8 22.4,34.8 29.2,34.8 30,35.6 30,36.5 32.1,38.6 35.3,38.6 37.42,36.48 LED6.C | v10.3,31.6 10.2,31.6 | LED3.C 8,28.7 10.5,28.7 | LED2.C 8.08,36.52 | 21.6,31.1 21.6,29.9 24.9,29.9 26.2,28.6 26.2,25.8 | 26.2,25.8 23.8,25.8 22.5,24.5 22.5,21.1 21.6,20.2 21.6,15.1 27.2,15.1 | 26.2,25.8 26.2,25 28.4,25 28.4,17.8 | 28.4,17.8 31,17.8 31.9,18.7 35.7,18.7 | 35.7,18.7 36.5,18.7 38.9,16.3 v38.9,15.9 | 36.5,21.8 35.7,21 35.7,18.7 | 15,17.8 15,28.7 v17,28.7 17.4,28.3 | 19.4,28.5 19.4,31.1 | 9.6,26.2 8.32,26.2 | 55.87,8.47 56,8.6 57.93,8.6 | v39.7,35.4 v38.8,35.4 | v47.3,35.8 47.3,37.3 | v47.3,33.5 47.3,33 | v52.4,38.1 v52.4,36.8 | v0.9,20.1 0.9,20.9
  Top 0.6: v12.5,5.6 12.1,5.6
  Top 0.8: v10.6,21.5 10.6,20.7 10.7,20.6
  Bottom 0.2: v14.6,12.8 14.6,13.5 v14.7,13.6 | v27.2,18 28.2,19
  Bottom 0.25: v38.9,15.9 v38.89,15.89 U1.5 35.11,15.89 35.1,15.9 | 35.1,15.9 C21.2 | U1.41 42.57,13.47 v42.7,13.6 | C11.2 44.6,8.9 45,8.5 45.4,8.5 v45.8,8.1 45.3,7.6 45.1,7.6 R17.2 | C15.1 35.7,21.5 v36.7,21.5 | 35.1,15.9 35.1,14.1 C20.2
  Bottom 0.4: R21.1 17.2,32.1 18.2,31.1 v18.3,31.1 18.5,31.1 R29.2 | v22.4,31.8 22.4,30.6 R30.1 21.6,30.6 v21.6,31.8 | R23.1 14.6,34.1 v15.6,33.1 | 9.3,30.6 Q1.C 9.5,30.6 10.3,31.4 v10.3,31.6 v10.3,34.2 | C23.2 v17,28.7 | D14.A 39.7,34.7 v39.7,35.4 | v38.8,35.4 38.8,34.2 39.7,34.2 39.7,34.3 | C3.- 47.3,34.65 | 47.3,34.65 v47.3,35.8 | 47.3,34.65 v47.3,33.5 | D13.2 54.06,38.16 54.1,38.1 v52.4,38.1 | v52.4,36.8 53.9,36.8 54,36.7 54,37.4 54.1,37.5 | 35.2,4 C9.1 35.2,4.6 v36,5.4 | R4.2 R5.1 11,3.1 10.7,3.4 10.7,5.6 | 10.7,5.6 v12.5,5.6 | C8.2 19.5,7.9 v21.2,7.9 | v2.5,20.1 v0.9,20.1 | 10.7,5.6 9.5,5.6 C5.2 | v17.7,4.3 v17.7,5.9 | U3.2 27.1,12.35 | 27.1,12.35 26.65,12.35 C19.2 | 27.1,12.35 27.2,12.45 v27.2,13.3 27.2,13.7 C22.2
  Bottom 0.6: U2.2 v12.5,5.6
  Bottom 0.8: C7.- 7.1,23.5 8.4,22.2 9.9,22.2 v10.6,21.5
  other vias: 13.8,12.6
  pour Top (isolate 0.25): 69.5,41.1 -1,41.1 -1,-0.9 69.5,-0.9
  pour Bottom: 8.4,12.5 14.5,12.5 14.9,12.9 14.9,17.7 14.7,17.9 12.4,17.9 12.1,17.6 12.1,16.3 11.8,16 8.5,16 8.2,15.7 8.2,12.7
IO1
  Bottom 0.2: U1.26 49.69,18.89 49.7,18.9 50.8,18.9 52.3,20.4 52.3,21.5 53,22.2 55,22.2 55.8,21.4 59.9,21.4 60.4,21.9 60.4,25.7 59.27,26.83 P1.7
IO2
  Bottom 0.2: U1.23 44.07,21.87 44.3,22.1 45.5,22.1 45.9,22.5 50.4,22.5 50.5,22.6 50.8,22.6 51.9,23.7 51.9,24.4 52.7,25.2 55,25.2 56.5,26.7 56.5,27.2 56.73,27.43 P1.8
IO3
  Bottom 0.2: P1.9 57.79,23.7 56.1,23.7 55.1,22.7 52.9,22.7 51.8,21.6 51.8,20.6 50.5,19.3 47.2,19.3 47.11,19.39 U1.25
IO4
  Bottom 0.2: 56.75,25.2 P1.10 56.48,25.18 56,24.7 52.9,24.7 52.4,24.2 52.4,23.5 51.1,22.2 50.8,22.2 50.6,22 46.1,22 45.7,21.6 44.6,21.6 44.6,20.97 U1.24
IO5  (via drill 0.3)
  Top 0.2: P1.13 58.07,18.9 56.3,18.9 55,17.6 53,17.6 51.5,19.1 50.7,19.1 49.7,20.1 v49.7,20.8 | v44.7,18.5 45.8,19.6 v45.8,20.5
  Bottom 0.2: U1.10 39.99,18.39 41,19.4 42.5,19.4 43.1,18.8 44.4,18.8 v44.7,18.5 | v45.8,20.5 46.4,20.5 46.7,20.8 v49.7,20.8
IO6
  Bottom 0.2: P1.14 52.7,20.1 51.1,18.5 50,18.5 49.9,18.4 U1.27
IO7
  Bottom 0.2: U1.28 49.99,17.89 50.15,18.05 51.35,18.05 52.9,19.6 55.5,19.6 56,19.1 57.73,19.1 P1.15
IO8
  Bottom 0.2: P1.16 56.27,17.1 52.9,17.1 52.2,16.4 U1.31
IO9
  Bottom 0.2: U1.33 48.11,15.39 51.1,12.4 55.1,12.4 56.3,13.6 57.5,13.6 57.9,14 58.8,14 59.27,13.53 P1.19
IO10
  Bottom 0.2: U1.34 47.91,14.89 50.9,11.9 55.8,11.9 56.4,12.5 56.71,12.5 P1.20
IO11
  Bottom 0.2: U1.35 47.71,14.39 49.5,12.6 51.3,10.7 52.1,9.9 56.29,9.9 P1.22
IO12
  Bottom 0.2: U1.40 43.07,10.83 43.8,10.1 50.3,10.1 53,7.4 55.1,7.4 56.1,8.4 58.27,8.4 P1.23
IO13
  Bottom 0.2: P1.24 56.4,7.4 55.9,6.9 52.8,6.9 50.1,9.6 49,9.6 45.4,6 41.9,6 41.5,6.4 41.5,10.4 40.57,11.33 U1.45
IO14  (via drill 0.3)
  Top 0.2: v50.7,5.4 51.3,4.8 52,4.8 52.4,4.4 55.3,4.4 56,3.7 58.1,3.7 59.3,4.9 59.3,4.89 P1.25
  Bottom 0.2: P2.5 61.2,19.8 61.2,17.2 60.4,16.4 60.4,8.3 60.3,8.2 60.3,7 59.27,5.97 P1.25 | v50.7,5.4 50.7,5.9 49.5,7.1 48.2,7.1 46.1,5 41.6,5 40.3,6.3 40.3,10.2 39.57,10.93 U1.47
IO15  (via drill 0.3)
  Top 0.2: P1.26 52.94,4.86 52.2,5.6 v51.7,5.6
  Bottom 0.2: P2.3 61.8,18.4 61.8,17 60.9,16.1 60.9,15.6 61.3,15.2 63.3,15.2 64.4,14.1 64.4,12 63.8,11.4 63.8,10.5 60.7,7.4 60.7,6.8 60.3,6.4 60.3,4.4 59.7,3.8 57.79,3.8 P1.26 | v51.7,5.6 51.3,6 51.3,6.2 49.9,7.6 47.9,7.6 45.8,5.5 41.75,5.5 40.9,6.35 40.9,10.3 40.07,11.13 U1.46
ISP_EN  (via drill 0.3)
  Top 0.2: P2.7 64,22.6 64,17 64.55,16.45 64.55,12.15 64.3,11.9 64.3,7.3 64.55,7.05 64.55,4.95 v63.7,4.1 | v36.5,8.4 36.6,8.3 37,8.3 v37.7,7.6
  Bottom 0.2: v63.7,4.1 63.1,4.1 62.3,3.3 56.8,3.3 55.2,4.9 52.7,4.9 51.6,3.8 39.75,3.8 37.7,5.85 v37.7,7.6 | U1.4 36.29,15.39 35.6,14.7 35.6,13.2 37.4,11.4 37.4,10.5 R14.1 v36.5,8.4
LT1  (via drill 0.3)
  Top 0.2: v18.1,29.1 17.9,29.3 17.2,29.3 16.7,29.8 D1.C 15.6,30.1 14.3,28.8 12.4,28.8 11.1,30.1 R6.2 | v39,27.5 39,27.3 38.9,27.2 38.9,26.4 39,26.3 39,24 38.4,23.4 v38.4,23.2
  Bottom 0.2: v18.1,29.1 18.3,28.9 20,28.9 20.5,28.4 20.5,23.4 20.8,23.1 30.2,23.1 31.1,24 37.6,24 v38.4,23.2 38.4,22.3 39.07,21.63 U1.13 | v39,27.5 39.8,27.5 40.4,26.9 42.6,26.9 42.8,26.7 45,26.7 46,25.7 46.6,25.7 47,26.1 49.7,26.1 52.2,28.6 52.29,28.69 52.34,28.74 P3.2
LT2  (via drill 0.3)
  Top 0.2: R7.2 v9.5,20.9 | v16.2,21.5 16.2,20.7 16.65,20.25 | 16.65,20.25 16.7,20.2 D2.C | v39.5,26.7 39.4,26.6 39.4,23.5 v39.3,23.4 | v21.2,23.8 21.2,23.9 18.4,23.9 18.1,23.6 18.1,21.8 17,20.7 17,20.6 16.65,20.25
  Bottom 0.2: U1.14 39.6,20.97 39.6,21.9 39.1,22.4 39.1,23.2 v39.3,23.4 | 39.3,23.2 v39.3,23.4 | v39.5,26.7 40,26.7 40.3,26.4 42.4,26.4 42.5,26.3 44.75,26.3 45.75,25.3 46.9,25.3 47.2,25.6 50,25.6 50.6,26.2 P3.3 | v39.3,23.4 38.2,24.5 30.5,24.5 29.8,23.8 v21.2,23.8 | v9.5,20.9 10,20.9 10.2,20.7 11.4,20.7 12.2,21.5 v16.2,21.5
LT3  (via drill 0.3)
  Top 0.2: v10,24.6 9.3,25.3 6.9,25.3 6.5,25.7 6.5,26 6,26.5 5,26.5 | v16.1,22.4 v17.5,22.4 | v51.1,21.5 49.5,23.1 49.5,23.6 v49.4,23.7 | v31.9,22.6 31.9,23.6 33.2,24.9 v33.2,25.7 | 5,26.5 2.6,26.5 R8.2 | D3.C 5,26.5
  Bottom 0.2: U1.19 42.07,21.87 42.1,21.9 42.1,23.7 42.2,23.8 42.2,24.8 | v10,24.6 12.2,22.4 v16.1,22.4 | v49.4,23.7 46,23.7 45.7,24 45.2,24 44.7,24.5 44.5,24.5 43.9,25.1 42.5,25.1 42.2,24.8 | v17.5,22.4 18,21.9 31.2,21.9 v31.9,22.6 | v33.2,25.7 39.1,25.7 40.3,24.5 41.1,24.5 41.4,24.8 42.2,24.8 | P3.4 53.26,23.66 v51.1,21.5
LT4  (via drill 0.3)
  Top 0.2: v22.8,10.1 22.8,6.2 23.7,5.3 D4.C 23.7,4.8 v22.7,3.8 | v50.4,23.3 51.23,22.47 51.83,22.47 53.18,21.12 P3.5 | v23,20.4 23.1,20.5 23.1,23.8 v24.3,25 | v43.7,24.1 43.7,25.9 41.9,27.7 41.9,28.1 v41.8,28.2 | v6.2,2.1 7.2,1.1 21.4,1.1 v21.7,1.4 | v6.3,8.3 7.2,8.3 7.6,8.7 7.7,8.7 R9.2
  Bottom 0.2: v50.4,23.3 50.3,23.3 50,23 45.9,23 45.4,23.5 45.05,23.5 44.55,24 43.8,24 43.6,23.8 | v24.3,25 24.9,25.6 32,25.6 32.7,26.3 37.8,26.3 38.2,26.7 38.2,27.6 38.7,28.1 41.7,28.1 v41.8,28.2 | U1.20 42.57,22.17 43.6,23.2 43.6,23.8 | 43.6,23.8 v43.7,24.1 | v6.3,8.3 6.3,7.7 6.5,7.5 6.5,2.4 v6.2,2.1 | v21.7,1.4 22.7,2.4 v22.7,3.8 | v23,20.4 23,19.8 22.8,19.6 v22.8,10.1
LT5  (via drill 0.3)
  Top 0.2: D5.C 32.5,30.1 33,30.6 R10.2 37.1,30.6 38.1,31.6 v38.1,32.7 | v50.5,20.3 51.5,20.3 53.22,18.58 P3.6 | v44.4,23.3 44.4,25.9 42.4,27.9 42.4,28.5 42.3,28.6 42.3,30.6 v42.7,31
  Bottom 0.2: v44.4,23.3 44.4,23.1 44.2,22.9 43.9,22.9 43.07,22.07 U1.21 43.07,20.03 43.3,19.8 44.7,19.8 45.1,20.2 45.1,20.7 45.6,21.2 46,21.2 46.3,21.5 50.1,21.5 50.5,21.1 v50.5,20.3 | v42.7,31 40.6,33.1 38.5,33.1 v38.1,32.7
LT6  (via drill 0.3)
  Top 0.2: D6.C R11.2 33.9,21.5 v34.1,21.5 | v48.3,20 50.2,18.1 51.2,18.1 53.26,16.04 P3.7
  Bottom 0.2: U1.18 41.57,19.8 | 41.57,19.8 38.7,19.8 38.3,20.2 38.3,20.8 36.3,22.8 34.9,22.8 34.1,22 v34.1,21.5 | 41.57,19.8 42.7,19.8 43.2,19.3 44.75,19.3 45.25,19.8 46.1,19.8 46.3,20 v48.3,20
LT7  (via drill 0.3)
  Top 0.2: R12.2 D7.C 30.7,9.9 29.7,8.9 v29.7,8.5 | v50.7,17 50.9,17 51.9,16 51.9,15 53.4,13.5 P3.8 | v41.5,15.1 41.1,14.7 40.5,14.7 39.2,13.4 39.2,11.6 38.4,10.8 v38.4,10.4 | v39.4,5 39.3,4.9 39.3,4 v38.65,3.35 | v31.4,3.3 v30.3,4.4
  Bottom 0.2: U1.30 50.6,16.9 v50.7,17 | U1.30 | U1.30 45.1,16.9 44.5,16.3 42.7,16.3 v41.5,15.1 | v29.7,8.5 29.7,5 v30.3,4.4 | v38.4,10.4 38.4,6 v39.4,5 | v38.65,3.35 38.3,3 34.2,3 33.9,3.3 v31.4,3.3
LT8  (via drill 0.3)
  Top 0.2: v51.8,13 51.8,12.5 53.34,10.96 P3.9 | v42.4,15 41.7,14.3 40.8,14.3 39.7,13.2 39.7,11.5 39,10.8 v39,8.9 | D8.C v24.7,8.7 | v40.1,4.5 39.7,4.1 39.7,3.7 39.3,3.3 v39.3,2.8 | v30.8,2.7 30.4,2.7 v29.5,3.6
  Bottom 0.2: v51.8,13 51.19,13 48.3,15.89 U1.32 45.19,15.89 45.1,15.8 43.2,15.8 v42.4,15 | v24.7,8.7 27.1,6.3 R13.2 28.7,4.4 v29.5,3.6 | v39,8.9 39,6.25 40.1,5.15 v40.1,4.5 | v39.3,2.8 38.9,2.4 34.1,2.4 33.9,2.6 30.9,2.6 v30.8,2.7
LT9  (via drill 0.3)
  Top 0.2: 21.1,36.3 17.8,36.3 16.75,37.35 S1.1 10.45,36.85 10.4,36.8 v10.4,36 | 21.1,36.3 22.1,37.3 24.4,37.3 S5.1 | S2.1 10.05,27.35 9.5,27.9 v8.8,27.9 | v10.3,18.6 10.3,17.6 S3.1 10.6,17.2 10.6,15.7 12.3,14 12.3,11.7 10.45,9.85 S4.1 | v22.8,28.4 23.25,27.95 23.45,27.95 24,27.4 S6.1 24.15,27.35 21.9,25.1 21.9,23.4 21.3,22.8 v21.3,21.2 | v21.1,34.7 21.1,36.3 | S8.1 24.05,7.35 23.7,7.7 23.7,8.6 v23.6,8.7 23.6,10.4 23.4,10.6 v23.4,10.7 | v23.7,16.1 23.7,16.9 23.9,17.1 24.2,17.1 S7.1 | v49.8,8.9 v49.8,11.3 | v48.4,4.5 v48.4,2.6 | v31.4,1.9 v29.4,1.9
  Bottom 0.2: v10.4,36 10,36.4 9.2,36.4 8.6,35.8 8.6,32.4 8.2,32 8.2,29.8 8.8,29.2 v8.8,27.9 7.7,27.9 6.1,26.3 6.1,18.2 6.7,17.6 9.3,17.6 v10.3,18.6 | v22.8,28.4 22.2,29 21.4,29 20.7,29.7 20.7,34.3 v21.1,34.7 | U1.38 44.07,11.33 44.2,11.2 44.8,11.2 44.9,11.3 v49.8,11.3 | v23.4,10.7 23.7,11 v23.7,16.1 23.7,20.7 23.2,21.2 v21.3,21.2 | v48.4,4.5 51.6,4.5 52.5,5.4 52.7,5.4 53,5.7 53,5.76 53.12,5.88 | v48.4,2.6 40.2,2.6 39.4,1.8 32.2,1.8 32.1,1.9 v31.4,1.9 | v23.6,8.7 27.9,4.4 27.9,3.4 v29.4,1.9 | P3.11 53.12,5.88 | 53.12,5.88 50.1,8.9 v49.8,8.9
LX
  Bottom 0.4: C1.1 16,9.6
  Bottom 0.6: U2.6 13.7,7
  Bottom 1: 13.7,7 13.7,8.8 14.5,9.6
  Bottom 1.3: L1.P$1 17.16,9.6 16,9.6 14.5,9.6 13.3,9.6 D10.C D9.C
N$1
  Bottom 0.2: R26.2 C17.1
N$2
  Bottom 0.2: C14.2 12,33.1 13,32.1 R20.1
N$3
  Bottom 0.2: U1.7 35.61,16.89 35,17.5 34.4,17.5 C21.1 32.3,17.9 X1.1
N$4  (via drill 0.3)
  Top 0.2: v46,29.5 LED11.A
  Bottom 0.2: v46,29.5 47.5,31 49.2,31 50.2,30 51,30 51.9,30.9 51.9,32.6 51.6,32.9 R28.2
N$5  (via drill 0.3)
  Top 0.2: R16.1 43.2,22.7 v42.7,23.2 | v42.8,24.5 42.8,26.1 41.3,27.6 41.3,27.8 41,28.1 v41,29.3
  Bottom 0.2: v42.7,23.2 42.7,24.4 v42.8,24.5 | v41,29.3 41,30.2 40.7,30.5 39.6,30.5 SJ1.2
N$6
  Bottom 0.2: Q3.3 26.3,26.8 27,26.1 29.5,26.1 30.1,26.7 30.2,26.7 R25.1
N$7
  Bottom 0.2: Q3.2 24.5,28.6 23.9,28.6 23.3,29.2 23.3,33.6 | 23.9,33.6 Q2.2
  Bottom 0.6: R30.2 23.3,33.6 23.9,33.6
N$8  (via drill 0.3)
  Top 0.6: L2.1 v48.5,32.6 | v44.2,36 v44.2,37.6
  Bottom 0.4: D11.C 36.8,36.8
  Bottom 0.6: 36.8,36.8 37.6,37.6 D14.C v44.2,37.6 | v48.5,32.6 45.7,32.6 45,33.3 45,35.2 v44.2,36
N$9
  Bottom 0.2: D16.3 33.5,28.2 34.3,29 35.2,29 35.5,29.3 36.1,29.3 36.6,29.8 D12.C
N$12
  Bottom 0.2: Q3.1 23.25,26.65 22.3,27.6 R26.1 21,28.1 21,28.6 R29.1
N$13
  Top 0.2: LED1.A 3.28,18.4 R3.2
N$14
  Bottom 0.2: R21.2 R20.2 | R18.1 R20.2 | R20.2 13,31.6 11.65,31.6 Q1.B
N$15
  Bottom 0.2: R24.2 28.4,30.6 27.71,31.29 27.1,31.29 | Q2.1 27.1,31.29 | C16.2 19.7,34.1 | 27.1,31.29 27.1,34.2 26.5,34.8 23.5,34.8 23,35.3 20.8,35.3 20,34.5 19.9,34.5 C16.2 | R22.2 C16.2
N$16
  Bottom 0.2: C18.1 28.7,14.5 U3.3
N$17
  Top 0.2: S8.3 22.75,2.85 22,3.6 22,4.2 22.2,4.4 22.2,8.9 21.5,9.6 21.5,9.9 D8.A
N$19
  Bottom 0.4: 13.5,4.5 14.8,4.5 15.7,5.4 15.8,5.4 C1.2
  Bottom 0.6: U2.1 13.5,4.5
N$20
  Bottom 0.2: R4.1 R1.2 7.9,6.4 11.6,6.4 11.6,6.7 U2.4
N$22
  Bottom 0.2: 32.6,14.7 32.6,16.3 33.2,16.9 34.9,16.9 35.41,16.39 U1.6 | 32.6,14.7 C20.1 | 32.6,14.7 30.7,14.7 C18.2 30.5,14.8 30.5,14.9 X1.3 28.2,16.5 C22.1
N$23
  Top 0.2: S7.3 24.75,12.85 27,10.6 27,10.4 D7.A
N$24
  Bottom 0.2: U2.3 11.55,3.65 11.9,3.3 12.7,3.3 13,3 R5.2 R2.1 15,2.2 16,3.2 18.3,3.2 19.1,2.4 19.2,2.4 C2.2
N$25
  Top 0.2: R6.1 7,31.4 8,32.4 LED2.A
N$28
  Top 0.2: S6.3 24.75,22.85 26,21.6 26,21.1 26.5,20.6 26.5,20.4 D6.A
N$29
  Top 0.2: S5.3 24.75,32.85 27,30.6 27,30.4 D5.A
N$30
  Top 0.2: S4.3 10.75,2.85 13,5.1 D4.A
N$31  (via drill 0.3)
  Top 0.2: S3.3 9.85,12.85 9.5,12.5 6.9,12.5 6.4,12 6.4,11.8 v5.5,10.9 | D3.A 4.7,24.4 4.3,24 v4.3,23
  Bottom 0.2: v4.3,23 4.3,19.9 2.4,18 2.4,12 3.5,10.9 v5.5,10.9
N$32
  Top 0.2: S2.3 10.75,22.85 13,20.6 13,20.4 D2.A
N$33
  Top 0.2: LED3.A 6.3,21.98 6.3,20.9 R7.1
N$34
  Top 0.2: S1.3 10.75,32.85 13,30.6 13,30.4 D1.A
N$35
  Top 0.2: R27.2 42.9,10.1 43.4,10.6 LED10.A
N$48  (via drill 0.3)
  Top 0.2: R8.1 2.5,23.7 1.7,22.9 1.7,17.5 2.6,16.6 v3.2,16.6 | LED4.A 7.42,13.68 7.4,14.2 7,14.6 v6.2,14.6
  Bottom 0.2: v6.2,14.6 4.2,16.6 v3.2,16.6
N$50  (via drill 0.3)
  Top 0.2: v6.2,9.7 7,10.5 7.4,10.5 7.6,10.7 7.7,10.7 R9.1 | LED5.A 6.02,3.68 v5.9,3.7
  Bottom 0.2: v5.9,3.7 3.8,3.7 2.3,5.2 2.3,7 3.7,8.4 4.9,8.4 v6.2,9.7
N$51
  Top 0.2: LED6.A 34.58,35.02 36,33.6 R10.1
N$53
  Top 0.2: LED7.A 34.58,25.02 35.1,24.5 35.1,21.6 34.6,21.1 34.6,20.1 R11.1
N$55
  Top 0.2: LED8.A 34.58,15.02 35.1,14.5 35.1,10.6 35,10.5 R12.1
N$57  (via drill 0.3)
  Top 0.2: LED9.A 34.6,5.2 33.8,6 v33.2,6
  Bottom 0.2: R13.1 31,6 v33.2,6
PROG1  (via drill 0.3)
  Top 0.2: LED10.C 47.42,8.38 48.5,7.3 | 48.5,7.3 50.5,7.3 S9.3 | 48.5,7.3 v48.5,6.4
  Bottom 0.2: U1.2 36.69,14.39 36.4,14.1 36.4,13.6 39,11 39,10.4 39.7,9.7 39.7,6.2 41.4,4.5 46.6,4.5 v48.5,6.4
PROG2  (via drill 0.3)
  Top 0.2: LED11.C 45.88,31.02 44.1,32.8 41.5,32.8 S10.3 41.15,32.85 41.1,32.8 v41.1,31.6 | v36.8,23.2 36.2,23.2 35.8,23.6 35.8,26.95 v35.15,27.6 | v38.1,29.2 38.8,29.9 v41.7,29.9
  Bottom 0.2: U1.12 37.52,19.88 36.7,20.7 33.9,20.7 33.4,21.2 33.4,22.2 34.5,23.3 36.6,23.3 36.7,23.2 v36.8,23.2 | v41.7,29.9 41.7,31 v41.1,31.6 | v35.15,27.6 35.15,28.15 35.6,28.6 37.5,28.6 v38.1,29.2
PWM  (via drill 0.3)
  Top 0.2: v41.7,18.8 41.7,20.3 41.5,20.5 v41.5,22.3 | v41.6,24.1 42,24.5 42,26.2 v40.7,27.5
  Bottom 0.2: U1.43 41.55,13.25 41.6,13.3 41.6,13.98 41.62,13.98 40.7,14.9 40.7,17.8 v41.7,18.8 | v41.5,22.3 41.6,22.3 v41.6,24.1 | P1.3 58.27,33.8 56,33.8 55.1,32.9 53.2,32.9 52.4,32.1 52.4,30.5 49.1,27.2 43,27.2 42.7,27.5 v40.7,27.5
REF
  Bottom 0.2: SJ1.3 39.48,32.1 38.4,32.1 38.2,31.9 33.3,31.9 32.55,31.15 D16.1 32.5,30.15 32.5,30 31.6,29.1 R25.2 30.5,29.1 28.5,27.1 R24.1
RESET  (via drill 0.3)
  Top 0.2: P2.10 66.1,24.5 66.1,16.6 64.95,15.45 64.95,4.05 64,3.1 v63.3,3.1
  Bottom 0.2: v63.3,3.1 63,2.8 56.6,2.8 55,4.4 52.9,4.4 51.8,3.3 39.6,3.3 38.7,4.2 C9.2 37.2,5.5 36.5,6.2 R15.1 36.6,7.3 36.6,7.4 37.8,8.6 37.8,11.6 36,13.4 36,14.4 36.49,14.89 U1.3
RXD  (via drill 0.3)
  Top 0.2: v48.3,12.8 v50.7,15.2
  Bottom 0.2: v48.3,12.8 47.84,12.34 U1.37 | v50.7,15.2 51.3,15.2 51.5,15 55.5,15 55.52,15.02 P1.18
SCL  (via drill 0.3)
  Top 0.2: P1.12 56.5,22.87 56.5,23.9 55.2,25.2 51.5,25.2 v51.3,25.4 | v39.8,22.6 39.8,22.9 39.9,23 39.9,25.8 v40,25.9
  Bottom 0.2: v51.3,25.4 50.6,25.4 50.3,25.1 47.4,25.1 47.2,24.9 45.5,24.9 44.5,25.9 v40,25.9 | U1.15 40.07,22.33 v39.8,22.6
SDA  (via drill 0.3)
  Top 0.2: P1.11 58.23,21.6 56.3,21.6 55.7,22.2 55.7,24 55,24.7 52.5,24.7 52.4,24.6 v50.8,24.6 | v40.5,23.3 40.4,23.4 40.4,25 v40.6,25.2
  Bottom 0.2: v50.8,24.6 50.7,24.5 45.3,24.5 44.9,24.9 44.8,24.9 44.2,25.5 42.3,25.5 42.1,25.3 40.7,25.3 v40.6,25.2 | U1.16 40.57,21.83 40.5,21.9 v40.5,23.3
SWCLK
  Bottom 0.2: U1.29 50.19,17.39 50.4,17.6 55.1,17.6 56.1,18.6 57.4,18.6 57.9,18.1 57.9,17.2 58.6,16.5 59.8,16.5 60.5,17.2 60.5,20.6 62.5,22.6 63.5,22.6 64,22.1 64,20.6 P2.4
SWDIO  (via drill 0.3)
  Top 0.2: v58.3,13.3 58.3,14.4 58.2,14.5 58.2,15.5 58.8,16.1 59.8,16.1 60,15.9 v61.6,15.9
  Bottom 0.2: U1.39 43.57,11.13 44,10.7 49.4,10.7 49.5,10.6 50.6,10.6 51.8,9.4 55.4,9.4 55.9,8.9 57.4,8.9 58.1,9.6 58.1,13.1 v58.3,13.3 | P2.2 63.3,15.9 v61.6,15.9
TXD  (via drill 0.3)
  Top 0.2: v47.6,13.5 v49.6,15.5
  Bottom 0.2: v47.6,13.5 47.2,13.9 U1.36 | v49.6,15.5 49.6,15.3 50.4,14.5 55.2,14.5 55.7,14 57.2,14 58.22,15.02 P1.17

### Text on the board
Top: www.selfbus.org
Bottom: BOT | 1
tPlace: LPC1115_4TE_TOP V1.0
bPlace: 1
bNames: LPC1115_4TE_TOP V1.0